# Altium schematic sheet Root.SchDoc
size A4; SheetNumber: 1; SheetTotal: 4
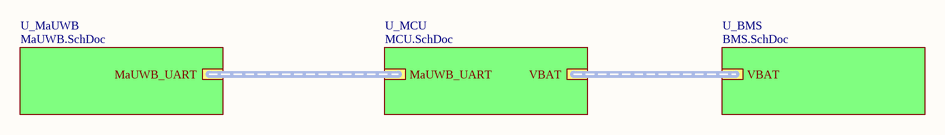
[diagram p0: Root.SchDoc]

## Sub-sheets
U_BMS = BMS.SchDoc: VBAT (harness VBAT)
U_MaUWB = MaUWB.SchDoc: MaUWB_UART (harness UWB_UART)
U_MCU = MCU.SchDoc: VBAT (harness VBAT), MaUWB_UART (harness UWB_UART)

## Buses and harness runs
harness sheet U_BMS/VBAT = sheet U_MCU/VBAT
harness sheet U_MaUWB/MaUWB_UART = sheet U_MCU/MaUWB_UART